# Altium schematic sheet oysm_Keyboard_Buttons.SchDoc: PCA70107 Connectors
size A4; DocumentNumber: 3; Revision: 0; SheetNumber: 3; SheetTotal: 4; ProjectNumber: <Project number>; DocumentSize: A4; PCBRevision: <PCB designer code>
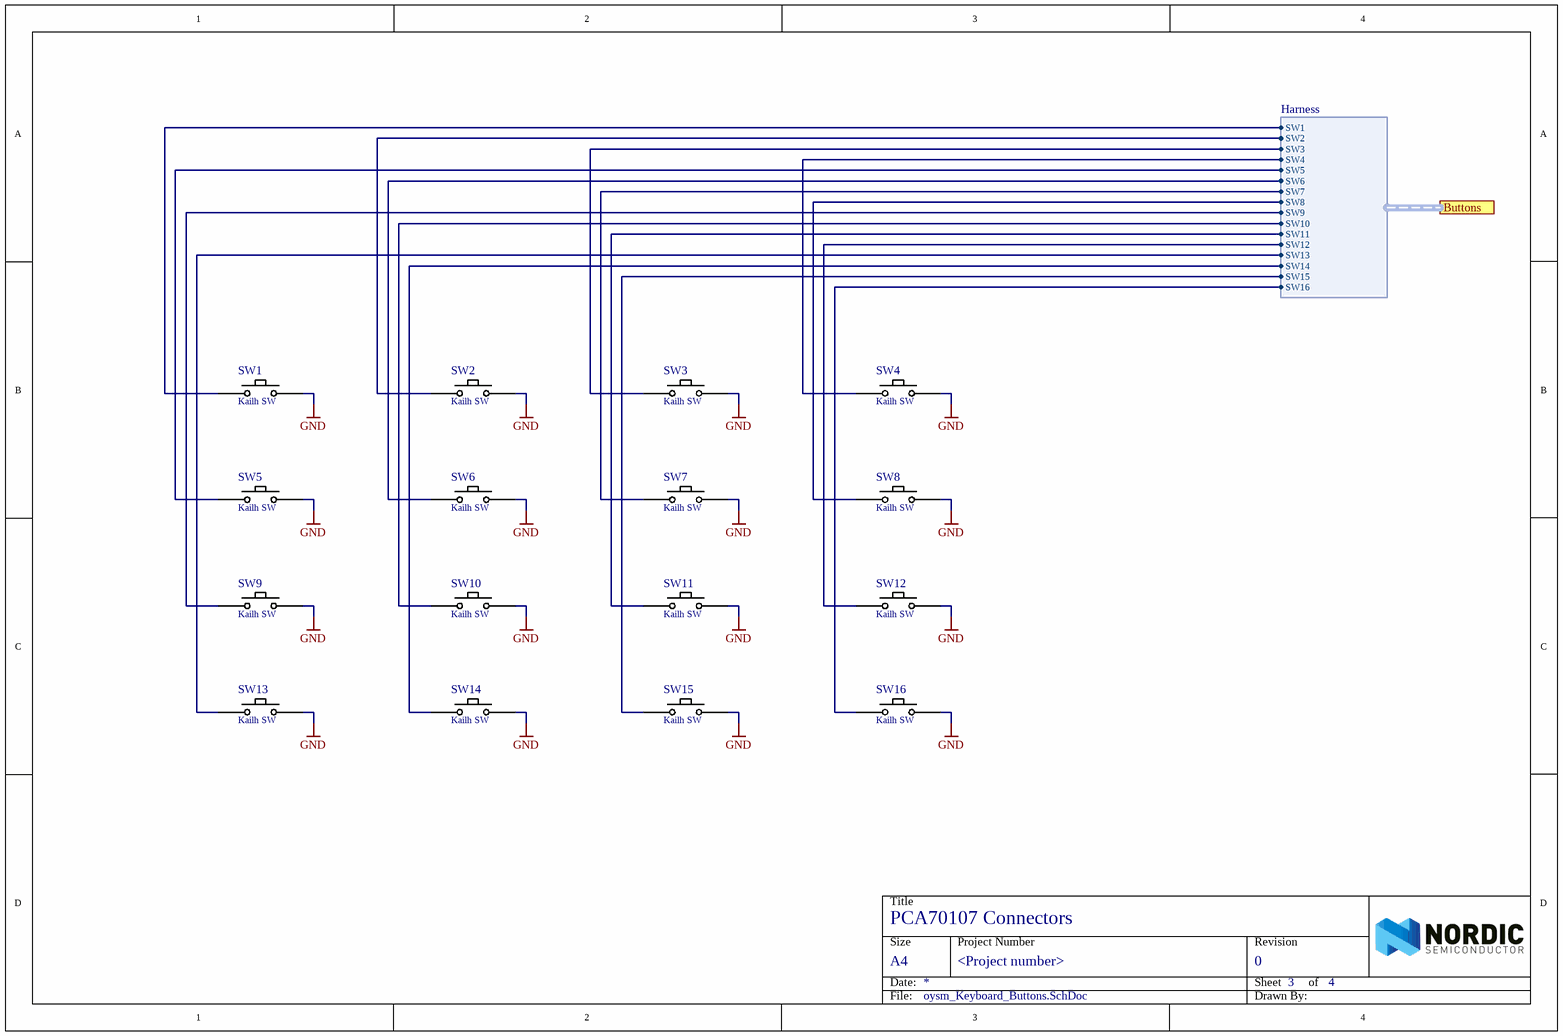
[diagram p0: oysm_Keyboard_Buttons.SchDoc]

## Parts
SW1  Kailh SW  [Kailh_Mechanical_Key]
SW2  Kailh SW  [Kailh_Mechanical_Key]
SW3  Kailh SW  [Kailh_Mechanical_Key]
SW4  Kailh SW  [Kailh_Mechanical_Key]
SW5  Kailh SW  [Kailh_Mechanical_Key]
SW6  Kailh SW  [Kailh_Mechanical_Key]
SW7  Kailh SW  [Kailh_Mechanical_Key]
SW8  Kailh SW  [Kailh_Mechanical_Key]
SW9  Kailh SW  [Kailh_Mechanical_Key]
SW10  Kailh SW  [Kailh_Mechanical_Key]
SW11  Kailh SW  [Kailh_Mechanical_Key]
SW12  Kailh SW  [Kailh_Mechanical_Key]
SW13  Kailh SW  [Kailh_Mechanical_Key]
SW14  Kailh SW  [Kailh_Mechanical_Key]
SW15  Kailh SW  [Kailh_Mechanical_Key]
SW16  Kailh SW  [Kailh_Mechanical_Key]

## Ports
Buttons (harness Harness)

## Harnesses
Harness: SW1, SW2, SW3, SW4, SW5, SW6, SW7, SW8, SW9, SW10, SW11, SW12, SW13, SW14, SW15, SW16

## Nets
GND: SW1.2 SW2.2 SW3.2 SW4.2 SW5.2 SW6.2 SW7.2 SW8.2 SW9.2 SW10.2 SW11.2 SW12.2 SW13.2 SW14.2 SW15.2 SW16.2
NetSW1_1: SW1.1 ; port Buttons.SW1
NetSW2_1: SW2.1 ; port Buttons.SW2
NetSW3_1: SW3.1 ; port Buttons.SW3
NetSW4_1: SW4.1 ; port Buttons.SW4
NetSW5_1: SW5.1 ; port Buttons.SW5
NetSW6_1: SW6.1 ; port Buttons.SW6
NetSW7_1: SW7.1 ; port Buttons.SW7
NetSW8_1: SW8.1 ; port Buttons.SW8
NetSW9_1: SW9.1 ; port Buttons.SW9
NetSW10_1: SW10.1 ; port Buttons.SW10
NetSW11_1: SW11.1 ; port Buttons.SW11
NetSW12_1: SW12.1 ; port Buttons.SW12
NetSW13_1: SW13.1 ; port Buttons.SW13
NetSW14_1: SW14.1 ; port Buttons.SW14
NetSW15_1: SW15.1 ; port Buttons.SW15
NetSW16_1: SW16.1 ; port Buttons.SW16

## Notes on the sheet
- Title
- Size
- Date:
- Project Number
- Sheet         of
- Revision
- File:
- Drawn By:

## Library data of the parts
SW1-SW16 = 5669: Kailh Mechanical keyboard switch; id: 5669; pakke_opprettet_av: 815; pris: 0; nokkelord: button; pakketype: TH; komponenttype: 12; pakke_opprettet: 07/02/2020 14:14:39; symbol_opprettet_av: 815; symbol_opprettet: 07/02/2020 14:22:32; navn: Kailh SW; produsent: Kailh